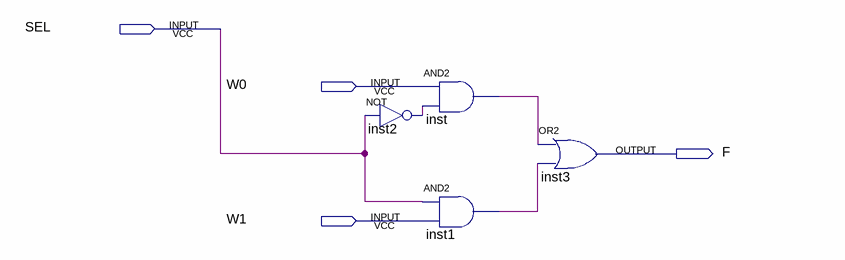
[diagram p0: schematic sheet]
// Quartus schematic 2x1Mux.bdf as structural Verilog: 4 symbols, 4 pins
module \2x1Mux  (
  input  SEL,
  input  W0,
  input  W1,
  output F
);

  wire inst1_out, inst2_out, inst_out;

  not inst2 (inst2_out, SEL);
  and inst (inst_out, W0, inst2_out);
  and inst1 (inst1_out, SEL, W1);
  or inst3 (F, inst_out, inst1_out);
endmodule
